# Altium schematic sheet 5_External_MCU_Connections.SchDoc
size A4; SheetNumber: 6; SheetTotal: 6
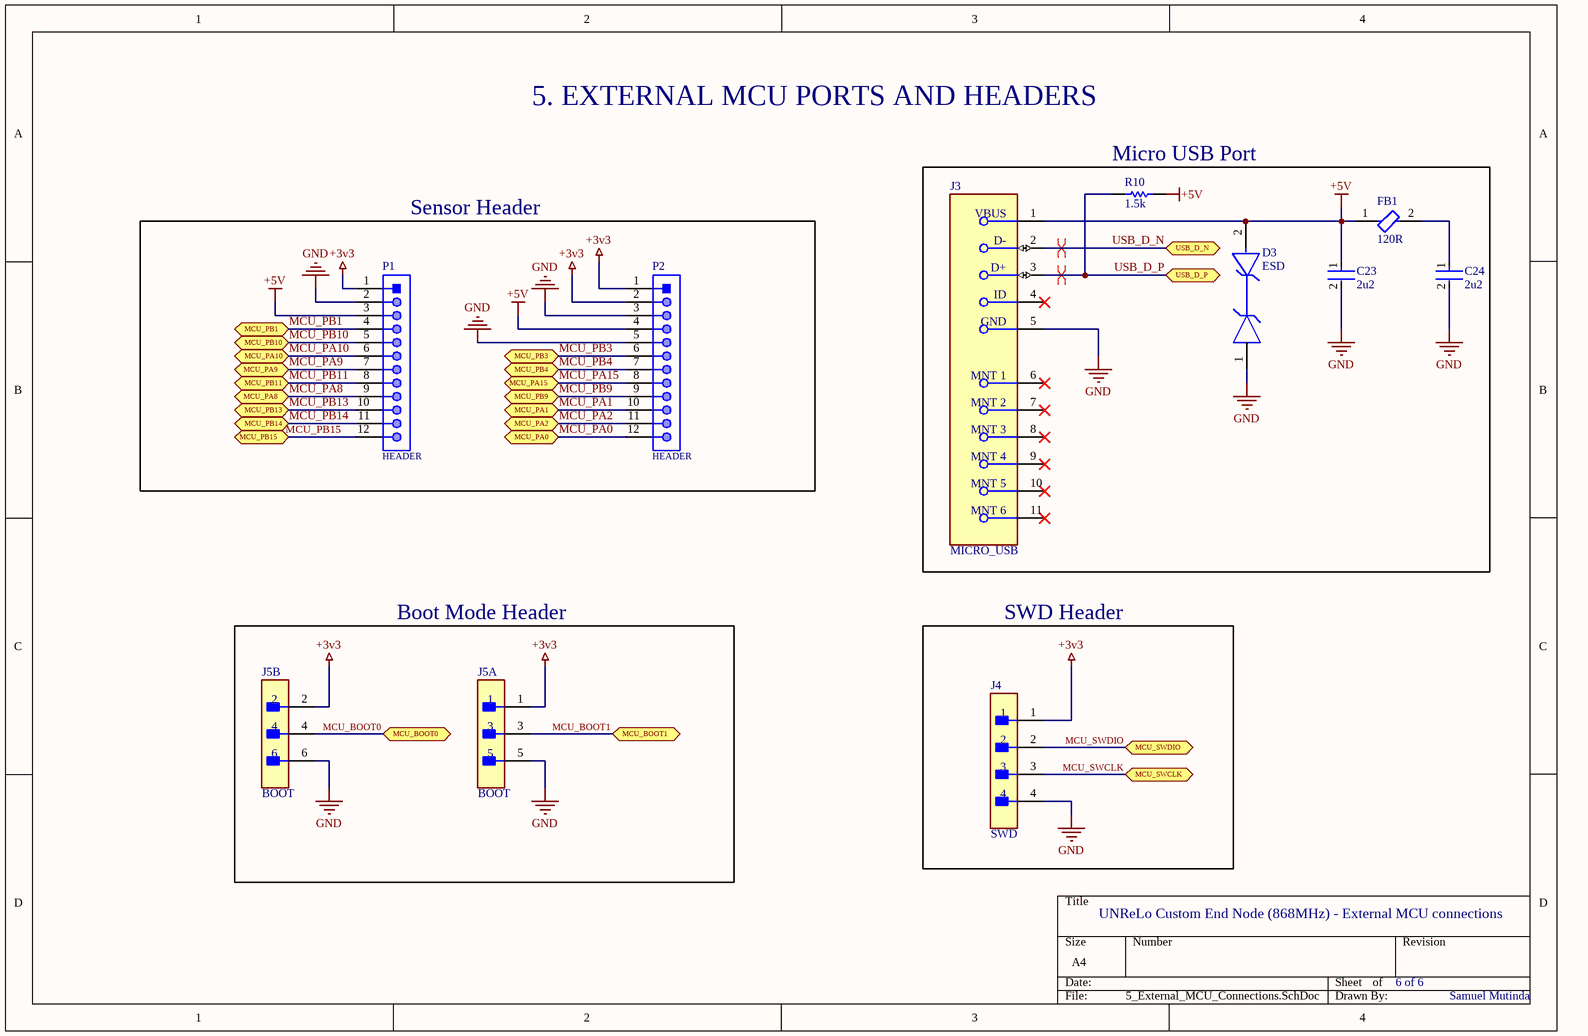
[diagram p0: 5_External_MCU_Connections.SchDoc]

## Parts
C23  2u2  [FP-C0603C225K4PACTU-MFG]
C24  2u2  [FP-C0603C225K4PACTU-MFG]
D3  ESD  [FP-711AM-CA-MFG]
FB1  120R  [FP-MMZ1005-IPC_B]
J3  MICRO_USB  [FP-473460001-MFG]
J4  SWD  [FP-47053-1000-MFG]
J5  BOOT  [FP-M20-9980346-MFG]  (parts A,B of 2)
P1  HEADER  [61301211121]
P2  HEADER  [61301211121]
R10  1.5k  [RESC1005X40X25ML05T10]

## Blocks framed on the sheet
Micro USB Port: C23 C24 D3 FB1 J3 R10
Sensor Header: P1 P2
Boot Mode Header: J5
SWD Header: J4

## Ports
MCU_BOOT0 (bidir), MCU_BOOT1 (bidir), MCU_PA0 (bidir), MCU_PA1 (bidir), MCU_PA2 (bidir), MCU_PA8 (bidir), MCU_PA9 (bidir), MCU_PA10 (bidir), MCU_PA15 (bidir), MCU_PB1 (bidir), MCU_PB3 (bidir), MCU_PB4 (bidir), MCU_PB9 (bidir), MCU_PB10 (bidir), MCU_PB11 (bidir), MCU_PB13 (bidir), MCU_PB14 (bidir), MCU_PB15 (bidir), MCU_SWCLK (bidir), MCU_SWDIO (bidir), USB_D_N (bidir), USB_D_P (bidir)

## Nets
+3v3: J4.1 J5.1 J5.2 P1.1 P2.1 P2.2
+5V: C23.1 D3.2 FB1.1 J3.1(VBUS) P1.3 P2.4 R10.2
GND: C23.2 C24.2 D3.1 J3.5(GND) J4.4 J5.5 J5.6 P1.2 P2.3 P2.5
MCU_BOOT0: J5.4 ; port MCU_BOOT0
MCU_BOOT1: J5.3 ; port MCU_BOOT1
MCU_PA0: P2.12 ; port MCU_PA0
MCU_PA1: P2.10 ; port MCU_PA1
MCU_PA2: P2.11 ; port MCU_PA2
MCU_PA8: P1.9 ; port MCU_PA8
MCU_PA9: P1.7 ; port MCU_PA9
MCU_PA10: P1.6 ; port MCU_PA10
MCU_PA15: P2.8 ; port MCU_PA15
MCU_PB1: P1.4 ; port MCU_PB1
MCU_PB3: P2.6 ; port MCU_PB3
MCU_PB4: P2.7 ; port MCU_PB4
MCU_PB9: P2.9 ; port MCU_PB9
MCU_PB10: P1.5 ; port MCU_PB10
MCU_PB11: P1.8 ; port MCU_PB11
MCU_PB13: P1.10 ; port MCU_PB13
MCU_PB14: P1.11 ; port MCU_PB14
MCU_PB15: P1.12 ; port MCU_PB15
MCU_SWCLK: J4.3 ; port MCU_SWCLK
MCU_SWDIO: J4.2 ; port MCU_SWDIO
USB_D_N: J3.2(D-) ; port USB_D_N
USB_D_P: J3.3(D+) R10.1 ; port USB_D_P
NetC24_1: C24.1 FB1.2

Not connected (* = marked no-connect by the designer): J3 4(ID)* 6(MNT_1)* 7(MNT_2)* 8(MNT_3)* 9(MNT_4)* 10(MNT_5)* 11(MNT_6)*

## Layout directives
differential pair; net class DIFF_USB: USB_D_N, USB_D_P

## Notes on the sheet
- 5. EXTERNAL MCU PORTS AND HEADERS
- UNReLo Custom End Node (868MHz) - External MCU connections
- 6 of 6
- Samuel Mutinda

## Library data of the parts
C23 C24 = CMP-2006-02259-2: CAP CER 2.2UF 16V X5R 0603; Manufacturer 1: Taiyo Yuden; Dielectric Material: Ceramic; Tolerance: 10%; Dissipation Factor: 5%; Name: EMK107BB7225MA-T; Series: C; Voltage Rating (DC): 16V; REACH SVHC: No SVHC; RoHS Compliant: Yes; Number of Pins: 2; Max Operating Temperature: 85°C; Voltage Rating: 16V; Min Operating Temperature: -55°C; Termination: SMD/SMT; Dielectric: X5R; Packaging: Tape and Reel; Contact Plating: Tin; Case Code (Metric): 1608; Height: 0.8mm; Capacitance: 2.2uF; Case/Package: 0603; Width: 0.8mm; Construction: Flat; Depth: 0.8mm; Thickness: 0.034inch; Radiation Hardening: No; Length: 1.6mm; Mount: Surface Mount; Case Code (Imperial): 0603; Voltage: 16V; Package Quantity: 1; Lead Free: Lead Free; Manufacturer Part Number 1: EMK107BB7225MA-T; Supplier 1: Digi-Key; Supplier Part Number 1: 587-4864-1-ND; Supplier Unit Price 1: $0.27
D3 = CMP-07200-000004-1: TVS DIODE 5.3V 2XDFN; Manufacturer 1: onsemi; Direction: Bidirectional; Number Of Channels: 1; Max Junction Temp: +150°C; Breakdown Voltage: 7V; Automotive Grade: Grade 0; Capacitance: 0.24pF; Clamping Voltage: 13V; Value: 0.24pF; Name: SZESD7471N2T5G; Package: 711AM-CA; Digikey Description: TVS DIODE 5.3V 2XDFN; Device Class L1: Circuit Protection; Automotive: Yes; Device Class L3: unset; ComponentLink2Description: Datasheet; Temperature Range High: +150°C; Height: 0.44mm; Device Class L2: TVS Diodes; Reverse Standoff Voltage: 5.3V; RoHS: TRUE; Mouser Description: Ultra-Low Capacitance ESD Protection low cap ESD protection in SOD-882; ComponentLink2URL: https://datasheet.octopart.com/SZESD7471N2T5G-ON-Semiconductor-datasheet-32011129.pdf; Temperature: -55°C to +150°C; Lead Free: Yes; Temperature Range Low: -55°C; Category: Diode; Footprint Url: https://www.onsemi.com/pub/Collateral/711AM.PDF; Octopart: https://octopart.com/szesd7471n2t5g-on+semiconductor-47358903; Manufacturer Part Number 1: SZESD7471N2T5G; Supplier 1: Digi-Key; Supplier Part Number 1: SZESD7471N2T5GOSCT-ND; Supplier Unit Price 1: $0.43
FB1 = CMP-08257-000110-1: Signal Line Ferrite Bead 120Ω @ 100MHz 500mA DCR 220mΩ SMD 0402; Manufacturer 1: Laird-Signal Integrity Products; DC Resistance (DCR): 250mR; Tolerance: 25%; Name: LI0402D121R-10; Series: MMZ; Height: 0.022inch; RoHS Compliant: Yes; Package Quantity: 1; REACH SVHC: No SVHC; Lead Free: Lead Free; Current Rating: 500mA; Packaging: Tape and Reel; Impedance: 120R; Case Code (Imperial): 0402; Width: 0.02inch; Max DC Current: 500mA; Core Material: Ferrite; Case Code (Metric): 1005; Depth: 0.5mm; Case/Package: 0402; Mount: Surface Mount; Length: 0.039inch; Manufacturer Part Number 1: LI0402D121R-10; Supplier 1: Digi-Key; Supplier Part Number 1: 240-2361-1-ND; Supplier Unit Price 1: $0.18
J3 = CMP-2000-05246-2: CONN RCPT USB2.0 MICRO B SMD R/A; Manufacturer 1: Molex; Conn Orientation: Right Angle; Is Female: yes; Shielding: true; Pitch: 0.65mm; Number Of Contacts: 5; Voltage Rating: 30V; Current Rating: 1.8A; Name: 0473460001; Device Class L2: USB Connectors; Digikey Description: CONN RCPT USB2.0 MICRO B SMD R/A; Height: 2.945mm; RoHS: TRUE; ComponentLink2Description: Datasheet; Octopart: https://octopart.com/47346-0001-molex-7164928; Automotive: No; Package: 0; Category: Conn; Device Class L1: Connectors; Usb Standard: USB 2.0; Temperature: -30°C to +85°C; Temperature Range Low: -30°C; Footprint Url: https://www.molex.com/pdm_docs/sd/473460001_sd.pdf; ComponentLink2URL: https://www.molex.com/webdocs/datasheets/pdf/en-us/0473460001_IO_CONNECTORS.pdf; Lead Free: Yes; Contact Material: Gold,Nickel; Temperature Range High: +85°C; Device Class L3: unset; Manufacturer Part Number 1: 0473460001; Supplier 1: Digi-Key; Supplier Part Number 1: WM17141CT-ND; Supplier Unit Price 1: $1.51
J4 = CMP-04776-000290-1: CONN HEADER VERT 4POS 2.54MM; Manufacturer 1: Sullins Connector Solutions; Number of Positions: 4; Voltage Rating (DC): 250V; Gender: Male; Current Rating: 4A; Glow Wire Compliant: Non-compliant; Name: PEC02DAAN; Contact Material: Brass; Contact Plating: Tin; Radiation Hardening: No; Package Quantity: 12000; Packaging: Bulk; Termination: Through Hole; Depth: 5.84mm; Series: 47053; Number of Contacts: 4; Length: 10.2mm; Halogen Free: Low Halogen; Number of Circuits: 4; Max Operating Temperature: 75°C; Housing Color: Beige; Min Operating Temperature: 0°C; Number of Rows: 1; Pitch: 2.54mm; Housing Material: Nylon; Orientation: Vertical; Mount: Through Hole; Voltage Rating: 250V; Manufacturer Part Number 1: PEC02DAAN; Supplier 1: Digi-Key; Supplier Part Number 1: S2012E-02-ND; Supplier Unit Price 1: $0.25
J5 = CMP-2000-06636-2: CONN HEADER VERT 6POS 2.54MM; Manufacturer 1: Harwin Inc.; Current Rating: 3A; Number Of Contacts: 6; Conn Gender: Male; Conn Orientation: Vertical; Name: M20-9980346; Device Class L1: Connectors; ComponentLink2Description: Datasheet; Height: 8.99mm; Temperature Range High: +105°C; Contact Material: Tin,Nickel; RoHS: TRUE; Temperature Range Low: -40°C; ComponentLink2URL: https://cdn.harwin.com/pdfs/M20-998.pdf; Digikey Description: CONN HEADER VERT 6POS 2.54MM; Pitch: 2.54mm; Package: M20-9980346; Device Class L2: Headers and Wire Housings; Number Of Rows: 2; Category: Conn; Lead Free: Yes; Mouser Description: 2.54mm (0.1") Pitch DIL Vertical PC Tail Pin Header, 6.1mm mating pin height, tin, 3+3 contacts; Temperature: -40°C to +105°C; Device Class L3: unset; Octopart: https://octopart.com/m20-9980346-harwin-5436545; Automotive: No; Manufacturer Part Number 1: M20-9980346; Supplier 1: Digi-Key; Supplier Part Number 1: 952-2121-ND; Supplier Unit Price 1: $0.3
P1 P2 = CMP-1502-01086-1: THT Vertical Pin Header WR-PHD, Pitch 2.54 mm, Single Row, 12 pins; Manufacturer 1: Würth Elektronik; Pin Number: 12; Gender: Male; Working Voltage: 250VAC; Rated Current: 3A; Withstanding Voltage: 500VAC; Pitch: 2.54mm; Contact Resistance: 20mOhm; Orientation: Vertical; Package Reference: 61301211121; Packaging: Bag; Operating Temperature: -40to105degC; Mounting Technology: THT; Manufacturer URL: http://www.we-online.de; Row Number: Single; Publisher: WurthElektronik; Datasheet URL: https://katalog.we-online.de/em/datasheet/6130xx11121.pdf; Name: 61301211121; Manufacturer Part Number 1: 61301211121; Supplier 1: Digi-Key; Supplier Part Number 1: 732-5323-ND; Supplier Unit Price 1: $0.57
R10 = CMP-2002-07464-1: Manufacturer: Yageo / Phycomp; Part Number: RC0402FR-071K5L; Manufacturer 1: YAGEO; Name: RC0402FR-071K5L; Manufacturer Part Number 1: RC0402FR-071K5L; Supplier 1: Digi-Key; Supplier Part Number 1: 311-1.50KLRCT-ND; Supplier Unit Price 1: $0.1